# EAGLE design Breadboard-Power-Adapter (EAGLE 7.5.0)
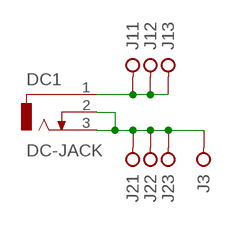
[diagram p0: schematic, sheet 1]

## Parts
DC1  DC-JACK  [DC-JACK]
J1  PINHD-1X3  [1X03]
J2  PINHD-1X3  [1X03]
J3  PINHD-1X1  [1X01]

## Nets
GND: DC1.2 DC1.3 J2.1 J2.2 J2.3 J3.1(KL)
VCC: DC1.1 J1.1 J1.2 J1.3

## Library data of the parts
DC1 = SaintGimp:DC-JACK: DC POWER JACK https://www.adafruit.com/datasheets/21mmdcjackDatasheet.pdf; OC_FARNELL: unknown; OC_NEWARK: unknown
J1 J2 = SaintGimp:PINHD-1X3: PIN HEADER
J3 = SaintGimp:PINHD-1X1

## Board
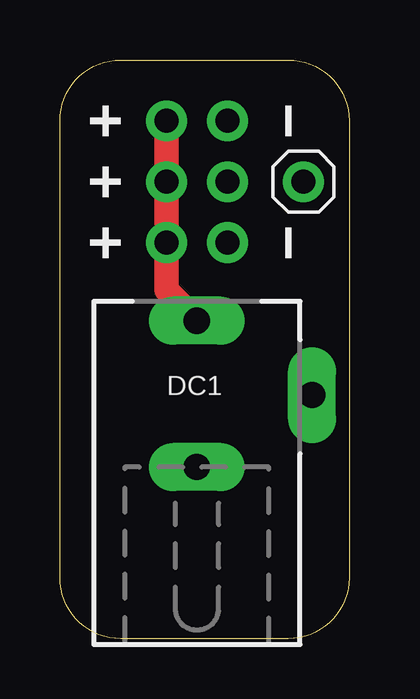
[diagram p1: board, top side]
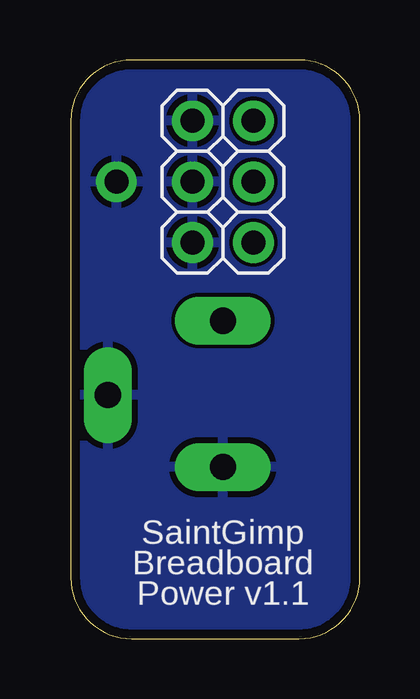
[diagram p2: board, bottom side, seen from below]

Size 12.06 x 24.13 mm. Coordinates in mm from the lower left corner, seen from the top.
Outline: 12.06,21.59 12.06,2.54 arc-90 9.53,0 2.54,0 arc-90 0,2.54 0,21.59 arc-90 2.54,24.13 9.53,24.13 arc-90 12.06,21.59
Copper layers (1*16): Top 0.0356mm / dielectric 1.5011mm / Bottom 0.0356mm
Design rules "Saintgimp-OSHPark *": minimum track width 10mil, minimum drill 13mil, track to track 6mil, track to pad 6mil, pad to pad 6mil, via to via 6mil, smd to smd 6mil, copper to edge 15mil, drill to drill 6mil, minimum pad ring 10mil, minimum via ring 7mil, stop-mask expansion 2mil, vias tented up to drill 24mil, thermal gap 10mil

### Footprints (pad centres in the part's own frame; a part is rotated, then mirrored left to right if it is on the bottom)
DC-JACK = drill 1.1 pad 2 long: 1 0,3.1; 2 4.8,0; 3 0,-3
1X03 = drill 1: 1 -2.54,0; 2 0,0; 3 2.54,0
1X01 = drill 1: 1 0,0

### Placement (x,y rotation side)
DC1  5.71,10.16 0 top
J1  4.45,19.05 90 bottom
J2  6.99,19.05 90 bottom
J3  10.16,19.05 0 top

### Tracks (layer width: path | path; a pad name or v marks a point on that pad's centre or on a via)
GND
  pour Bottom: 0,0 0,24.13 12.06,24.13 12.06,0
VCC
  Top 1.016: DC1.1 4.45,14.53 J1.1 J1.2 J1.3

### Text on the board
_bsilk: SaintGimp | Breadboard | Power v1.1